# EAGLE schematic EXT_ADIN (EAGLE 6.4)
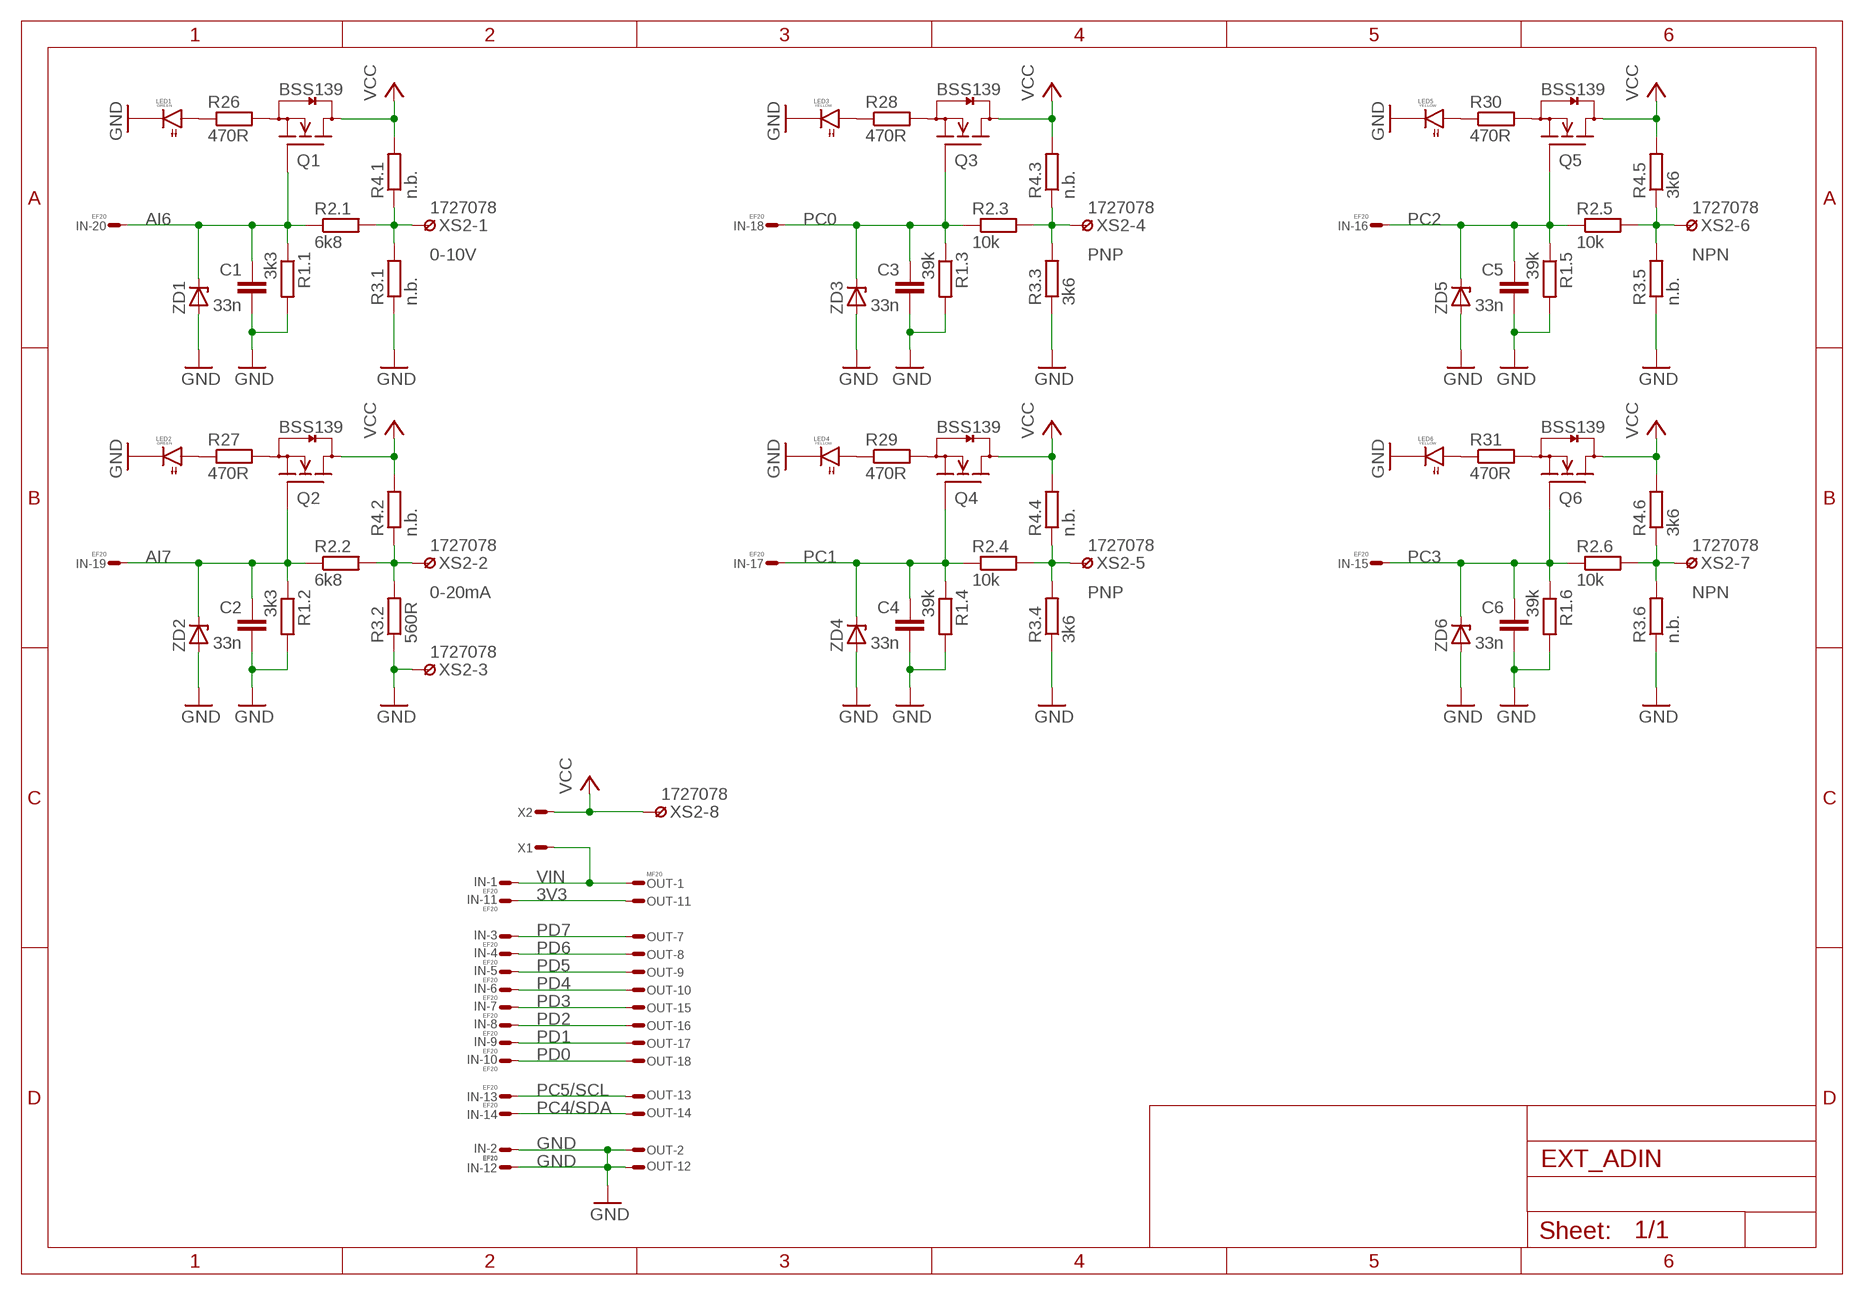
[diagram p0: schematic, sheet 1]

## Parts
C1  33n  C1206  [1206]
C2  33n  C1206  [1206]
C3  33n  C1206  [1206]
C4  33n  C1206  [1206]
C5  33n  C1206  [1206]
C6  33n  C1206  [1206]
IN  EF20  FE20ELS  [FE10-2WS]
LED1  GREEN  LED1206  [1206]
LED2  GREEN  LED1206  [1206]
LED3  YELLOW  LED1206  [1206]
LED4  YELLOW  LED1206  [1206]
LED5  YELLOW  LED1206  [1206]
LED6  YELLOW  LED1206  [1206]
OUT  MF20  ML20LSE  [ML20LS]
Q1  BSS139  FET-ND23  [SOT23]
Q2  BSS139  FET-ND23  [SOT23]
Q3  BSS139  FET-ND23  [SOT23]
Q4  BSS139  FET-ND23  [SOT23]
Q5  BSS139  FET-ND23  [SOT23]
Q6  BSS139  FET-ND23  [SOT23]
R1.1  3k3  R1206  [1206]
R1.2  3k3  R1206  [1206]
R1.3  39k  R1206  [1206]
R1.4  39k  R1206  [1206]
R1.5  39k  R1206  [1206]
R1.6  39k  R1206  [1206]
R2.1  6k8  R1206  [1206]
R2.2  6k8  R1206  [1206]
R2.3  10k  R1206  [1206]
R2.4  10k  R1206  [1206]
R2.5  10k  R1206  [1206]
R2.6  10k  R1206  [1206]
R3.1  n.b.  R1206  [1206]
R3.2  560R  R1206  [1206]
R3.3  3k6  R1206  [1206]
R3.4  3k6  R1206  [1206]
R3.5  n.b.  R1206  [1206]
R3.6  n.b.  R1206  [1206]
R4.1  n.b.  R1206  [1206]
R4.2  n.b.  R1206  [1206]
R4.3  n.b.  R1206  [1206]
R4.4  n.b.  R1206  [1206]
R4.5  3k6  R1206  [1206]
R4.6  3k6  R1206  [1206]
R26  470R  R1206  [1206]
R27  470R  R1206  [1206]
R28  470R  R1206  [1206]
R29  470R  R1206  [1206]
R30  470R  R1206  [1206]
R31  470R  R1206  [1206]
X1  WIREPADT1.6/0.9  [T1.6/0.9]
X2  WIREPADT1.6/0.9  [T1.6/0.9]
XS2  1727078  CON8-S  [SCR_381_8]
ZD1  ZDSOD80  [SOD80]
ZD2  ZDSOD80  [SOD80]
ZD3  ZDSOD80  [SOD80]
ZD4  ZDSOD80  [SOD80]
ZD5  ZDSOD80  [SOD80]
ZD6  ZDSOD80  [SOD80]

## Nets
3V3: IN.P$11 OUT.P$11
AI6: C1.1 IN.P$20 Q1.1(G) R1.1.1 R2.1.1 ZD1.C
AI7: C2.1 IN.P$19 Q2.1(G) R1.2.1 R2.2.1 ZD2.C
GND: C1.2 C2.2 C3.2 C4.2 C5.2 C6.2 IN.P$2 IN.P$12 LED1.2(C) LED2.2(C) LED3.2(C) LED4.2(C) LED5.2(C) LED6.2(C) OUT.P$2 OUT.P$12 R1.1.2 R1.2.2 R1.3.2 R1.4.2 R1.5.2 R1.6.2 R3.1.1 R3.2.1 R3.3.1 R3.4.1 R3.5.1 R3.6.1 XS2.P$3 ZD1.A ZD2.A ZD3.A ZD4.A ZD5.A ZD6.A
N$1: R2.2.2 R3.2.2 R4.2.1 XS2.P$2
N$2: R2.3.2 R3.3.2 R4.3.1 XS2.P$4
N$3: R2.1.2 R3.1.2 R4.1.1 XS2.P$1
N$4: R2.4.2 R3.4.2 R4.4.1 XS2.P$5
N$5: R2.5.2 R3.5.2 R4.5.1 XS2.P$6
N$6: R2.6.2 R3.6.2 R4.6.1 XS2.P$7
N$8: LED1.1(A) R26.1
N$9: Q1.2(S) R26.2
N$10: LED2.1(A) R27.1
N$11: Q2.2(S) R27.2
N$12: LED3.1(A) R28.1
N$13: Q3.2(S) R28.2
N$14: LED4.1(A) R29.1
N$15: Q4.2(S) R29.2
N$16: LED5.1(A) R30.1
N$17: Q5.2(S) R30.2
N$18: LED6.1(A) R31.1
N$19: Q6.2(S) R31.2
PC0: C3.1 IN.P$18 Q3.1(G) R1.3.1 R2.3.1 ZD3.C
PC1: C4.1 IN.P$17 Q4.1(G) R1.4.1 R2.4.1 ZD4.C
PC2: C5.1 IN.P$16 Q5.1(G) R1.5.1 R2.5.1 ZD5.C
PC3: C6.1 IN.P$15 Q6.1(G) R1.6.1 R2.6.1 ZD6.C
PC4/SDA: IN.P$14 OUT.P$14
PC5/SCL: IN.P$13 OUT.P$13
PD0: IN.P$10 OUT.P$18
PD1: IN.P$9 OUT.P$17
PD2: IN.P$8 OUT.P$16
PD3: IN.P$7 OUT.P$15
PD4: IN.P$6 OUT.P$10
PD5: IN.P$5 OUT.P$9
PD6: IN.P$4 OUT.P$8
PD7: IN.P$3 OUT.P$7
VCC: Q1.3(D) Q2.3(D) Q3.3(D) Q4.3(D) Q5.3(D) Q6.3(D) R4.1.2 R4.2.2 R4.3.2 R4.4.2 R4.5.2 R4.6.2 X2.1(S) XS2.P$8
VIN: IN.P$1 OUT.P$1 X1.1(S)
Unconnected: OUT.P$3 OUT.P$4 OUT.P$5 OUT.P$6 OUT.P$19 OUT.P$20

## Notes on the sheet
- 0-10V | PNP | NPN
- 0-20mA | PNP | NPN

## Library data of the parts
C1-C6 = RCL:C: Capacitor SMD
IN = Conn:FE20E
LED1-LED6 = Optic:LED
OUT = Conn:ML20?E: HARTING
Q1-Q6 = Transistor:FET-ND
R1.1-R1.6 R2.1-R2.6 R3.1-R3.6 R4.1-R4.6 R26-R31 = RCL:R: Resistor SMD
X1 X2 = Conn:WIREPAD: Wire PAD connect wire on PCB
XS2 = Conn:CON8-S
ZD1-ZD6 = Diode:ZD